# Altium project SMPSProject.PrjPcb
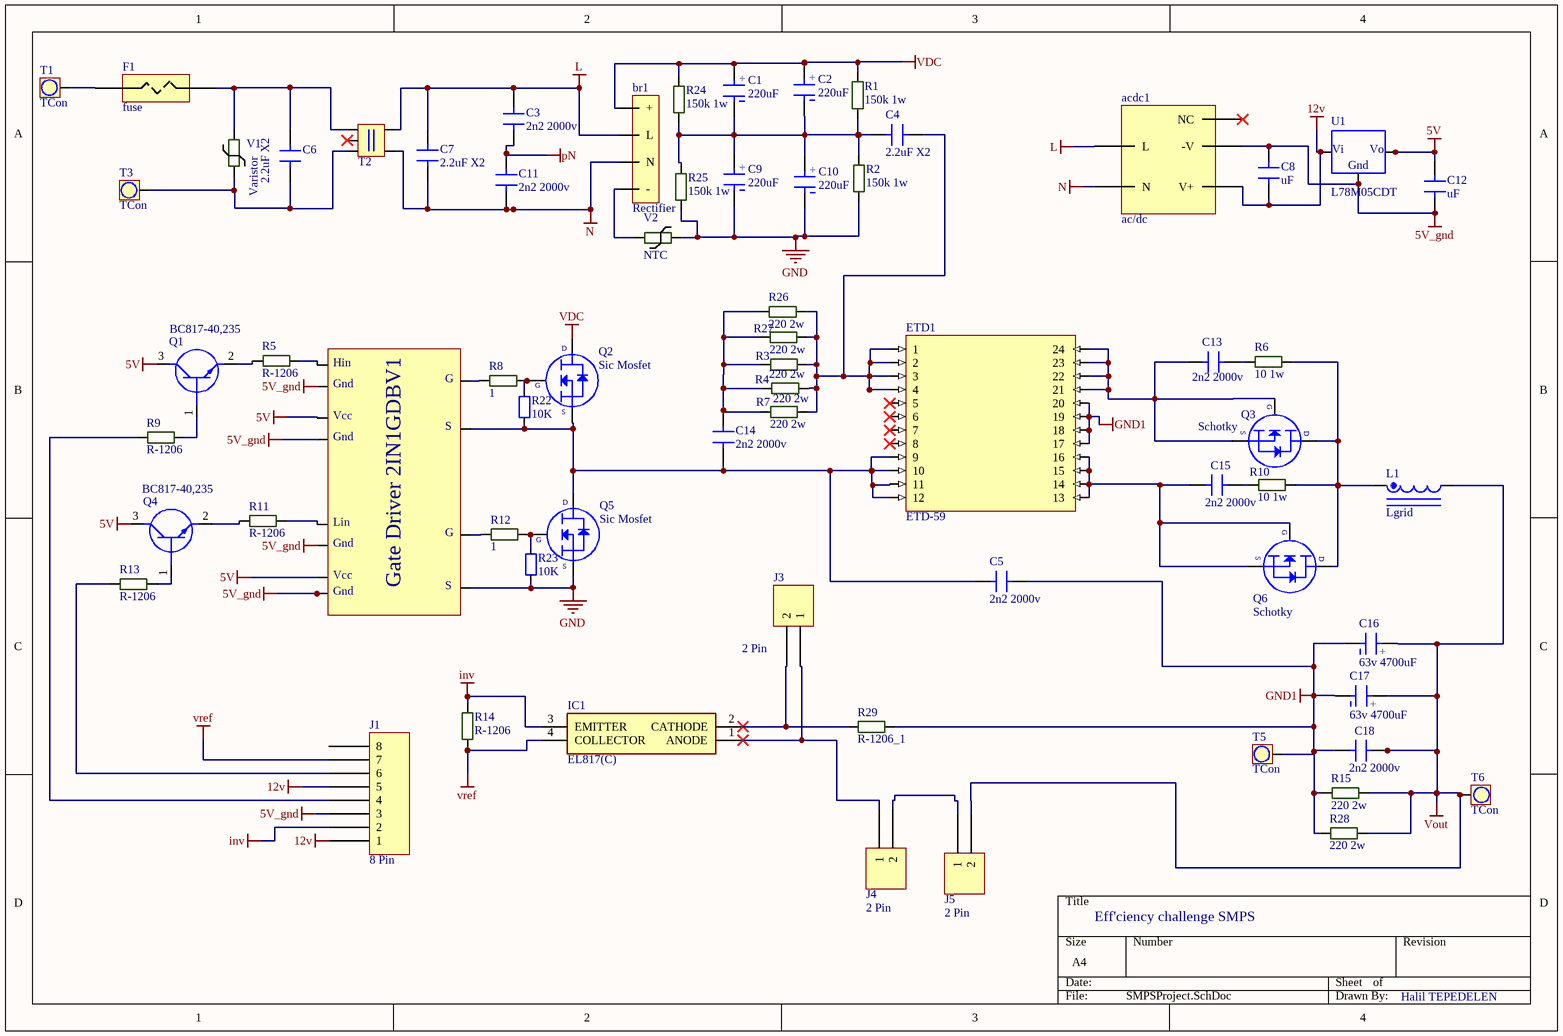
[diagram p0: SMPSProject.SchDoc]
2 sheets, 82 parts. Net scope: global (net labels, ports and power ports of the same name join across sheets).
Board files: SMPSProject.PcbDoc, controller.PcbDoc
Sheets:
  SMPSProject.SchDoc
  controller.SchDoc

## Sheet SMPSProject.SchDoc
size A4; SheetNumber: 1; SheetTotal: 2

### Parts
acdc1  ac/dc  [ac/dc]
br1  Rectifier  [Rectifier]
C1  220uF  [Koshin]
C2  220uF  [Koshin]
C3  2n2 2000v  [2n2 2000v]
C4  2.2uF X2  [CAP.POL 2.2UF  x2]
C5  2n2 2000v  [2n2 2000v]
C6  2.2uF X2  [CAP.POL 2.2UF  x2]
C7  2.2uF X2  [CAP.POL 2.2UF  x2]
C8  uF  [C-1206]
C9  220uF  [Koshin]
C10  220uF  [Koshin]
C11  2n2 2000v  [2n2 2000v]
C12  uF  [C-1206]
C13  2n2 2000v  [2n2 2000v]
C14  2n2 2000v  [2n2 2000v]
C15  2n2 2000v  [2n2 2000v]
C16  63v 4700uF  [Koshin 63v 4700 cap]
C17  63v 4700uF  [Koshin 63v 4700 cap]
C18  2n2 2000v  [2n2 2000v]
ETD1  ETD-59  [ETD-59]
F1  fuse  [fuse holder]
G1  GateDriver Board  [Gate Driver]  (value not drawn)
IC1  EL817(C)  [DIP762W60P254L458H480Q4N]
J1  8 Pin  [8 pin connector]
J3  2 Pin  [2pin]
J4  2 Pin  [2pin]
J5  2 Pin  [2pin]
L1  Lgrid  [Lgrid]
Q1  BC817-40,235  [SOT95P230X110-3N]
Q2  Sic Mosfet  [IFX-PG-TO247-3-41]
Q3  Schotky  [IFX-PG-TO247-3-41]
Q4  BC817-40,235  [SOT95P230X110-3N]
Q5  Sic Mosfet  [IFX-PG-TO247-3-41]
Q6  Schotky  [IFX-PG-TO247-3-41]
R1  150k 1w  [R-2512]
R2  150k 1w  [R-2512]
R3  220 2w  [R-2512]
R4  220 2w  [R-2512]
R5  R-1206  [R-1206]
R6  10 1w  [R-2512]
R7  220 2w  [R-2512]
R8  1  [R-2512W]
R9  R-1206  [R-1206]
R10  10 1w  [R-2512]
R11  R-1206  [R-1206]
R12  1  [R-2512W]
R13  R-1206  [R-1206]
R14  R-1206  [R-1206]
R15  220 2w  [R-2512]
R22  10K  [R-0805R]
R23  10K  [R-0805R]
R24  150k 1w  [R-2512]
R25  150k 1w  [R-2512]
R26  220 2w  [R-2512]
R27  220 2w  [R-2512]
R28  220 2w  [R-2512]
R29  R-1206_1  [R-1206]
T1  TCon  [tCon]
T2  Transformer  [Transformer]  (value not drawn)
T3  TCon  [tCon]
T5  TCon  [tCon]
T6  TCon  [tCon]
U1  L78M05CDT  [TO-252]
V1  Varistor  [varistor]
V2  NTC  [varistor]

### Nets
5V: C12.2 G1.3 G1.7 Q1.3(C) Q4.3(C) U1.2
5V_gnd: acdc1.4(-V) C8.2 C12.1 G1.2 G1.4 G1.6 G1.8 J1.3 U1.3
12v: acdc1.5(V+) C8.1 J1.1 J1.5 U1.1
GND: C9.1 C10.1 G1.12 Q5.3 R2.1 R23.1 R25.1 V2.1
GND1: C5.1 C16.1 C17.1 C18.2 ETD1.17 ETD1.18 ETD1.19 ETD1.20 R15.2 R28.2 R29.2 T5.1
inv: IC1.3(EMITTER) J1.2 R14.1
L: acdc1.1(L) br1.2(L) C3.2 C7.2 T2.2
N: acdc1.2(N) br1.3(N) C7.1 C11.1 T2.1
pN: C3.1 C11.2
VDC: br1.1(+) C1.2 C2.2 Q2.2 R1.2 R24.2
Vout: C16.2 C17.2 C18.1 J5.2 L1.2 R15.1 R28.1 T6.1
vref: IC1.4(COLLECTOR) J1.7 R14.2
Netbr1_4: br1.4(-) V2.2
NetC1_1: C1.1 C2.1 C4.2 C9.2 C10.2 R1.1 R2.2 R24.1 R25.2
NetC4_1: C4.1 ETD1.1 ETD1.2 ETD1.3 ETD1.4 R3.1 R4.1 R7.1 R26.1 R27.1
NetC5_2: C5.2 C14.1 ETD1.9 ETD1.10 ETD1.11 ETD1.12 G1.10 Q2.3 Q5.2 R22.1
NetC6_1: C6.1 T2.4 T3.1 V1.1
NetC6_2: C6.2 F1.1 T2.3 V1.2
NetC13_1: C13.1 R6.1
NetC13_2: C13.2 ETD1.21 ETD1.22 ETD1.23 ETD1.24 Q3.1 Q3.3
NetC14_2: C14.2 R3.2 R4.2 R7.2 R26.2 R27.2
NetC15_1: C15.1 R10.1
NetC15_2: C15.2 ETD1.13 ETD1.14 ETD1.15 ETD1.16 Q6.1 Q6.3
NetF1_2: F1.2 T1.1
NetG1_1: G1.1 R5.2
NetG1_5: G1.5 R11.2
NetG1_9: G1.9 R8.1
NetG1_11: G1.11 R12.1
NetIC1_1: IC1.1(ANODE) J3.1 J4.1
NetIC1_2: IC1.2(CATHODE) J3.2 R29.1
NetJ1_4: J1.4 R9.1
NetJ1_6: J1.6 R13.1
NetJ4_2: J4.2 J5.1
NetL1_1: L1.1 Q3.2 Q6.2 R6.2 R10.2
NetQ1_1: Q1.1(B) R9.2
NetQ1_2: Q1.2(E) R5.1
NetQ2_1: Q2.1 R8.2 R22.2
NetQ4_1: Q4.1(B) R13.2
NetQ4_2: Q4.2(E) R11.1
NetQ5_1: Q5.1 R12.2 R23.2

Not connected (* = marked no-connect by the designer): acdc1 3(NC)*; ETD1 5* 6* 7* 8*; J1 8; T2 5*

### Notes on the sheet
- Eff'ciency challenge SMPS
- Halil TEPEDELEN
- (in symbol Aluminum Electrolytic Capacitors) +
- (in symbol CAP.EL.220uF 500V) +
- (in symbol GateDriver Board) Hin; G; Gnd; Vcc; S; Lin; Gate Driver 2IN1GDBV1
- (in symbol L78M15CDT_1) Vi; Vo; Gnd
- (in symbol Sic Mosfet To247) D; G; S

### Library data of the parts
C1 C2 C9 C10 = CAP.EL.220uF 500V: ComponentLink1Description: https://www.ozdisan.com/pasif-komponentler/kondansatorler/aluminyum-kondansatorler/K055002210PM0E040; ComponentLink1URL: https://www.ozdisan.com/pasif-komponentler/kondansatorler/aluminyum-kondansatorler/K055002210PM0E040
C8 C12 = C-1206
C16 C17 = Aluminum Electrolytic Capacitors: PKL5-063V472MM450 Aluminum Electrolytic Capacitors - Snap In 63volts 4700uF 20%; Manufacturer: Nichicon; Manufacturer Part Number: LKS1J472MESZ; Capacitance: 4.7mF; Ripple Current: 3A; Life (Hours): 1000Hour; Supplier 1: Mouser; RoHS: Yes; Mount: Through Hole; Case/Package: Radial; Min Operating Temperature: -40°C; Max Operating Temperature: 85°C; Package Quantity: 250; Voltage Rating: 63V; Tolerance: 20%; Packaging: Bulk; Voltage Rating (DC): 63V; Termination: Snap in; Diameter: 22mm; Length: 45mm; Lead Pitch: 0.394inch; Height - Seated (Max): 1.772inch; Supplier Part Number 1: 647-LKS1J472MESZ; ComponentLink2Description: https://www.ozdisan.com/pasif-komponentler/kondansatorler/aluminyum-kondansatorler/PKL5-063V472MM450; ComponentLink2URL: https://www.ozdisan.com/pasif-komponentler/kondansatorler/aluminyum-kondansatorler/PKL5-063V472MM450
IC1 = EL817(C): Integrated Circuit; Manufacturer_Name: Everlight; Datasheet Link: https://componentsearchengine.com/Datasheets/1/EL817(C).pdf; Height: 4.8mm; Manufacturer_Part_Number: EL817(C); Mouser Part Number: 638-EL817C; Mouser Price/Stock: https://www.mouser.com/Search/Refine.aspx?Keyword=638-EL817C
Q1 Q4 = BC817-40,235: Transistor BJT NPN; Manufacturer_Name: Nexperia; Datasheet Link: http://assets.nexperia.com/documents/data-sheet/BC817_BC817W_BC337.pdf; Height: 1.1mm; Manufacturer_Part_Number: BC817-40,235; Mouser Part Number: 771-BC817-40235; Mouser Price/Stock: https://www.mouser.com/Search/Refine.aspx?Keyword=771-BC817-40235; RS Part Number: 1707957; RS Price/Stock: http://uk.rs-online.com/web/p/products/1707957
Q2 Q3 Q5 Q6 = Sic Mosfet To247
R1-R3 R7 R15 R24-R28 = R-2512: 10 1w
R4 R6 R10 = R-2512
R5 R9 R11 R13 R14 = R-1206: Res1206
R8 R12 = 0207 melf: ComponentLink1Description: https://www.ozdisan.com/pasif-komponentler/direncler/smt-smd-direncler/M271UFG100KT20; ComponentLink1URL: https://www.ozdisan.com/pasif-komponentler/direncler/smt-smd-direncler/M271UFG100KT20
R22 R23 = 10K 0805
R29 = R-1206_1: Res1206
T1 T3 T5 T6 = Terminal Connector: ComponentLink1Description: https://www.ozdisan.com/konnektor-baglanti-elemanlari/terminal-konnektorler/vida-tipi-konnektorler/K36-00AH; ComponentLink1URL: https://www.ozdisan.com/konnektor-baglanti-elemanlari/terminal-konnektorler/vida-tipi-konnektorler/K36-00AH
U1 = L78M15CDT_1: Manufacturer: STMicroelectronics; Max Output Current: 500mA; Output Voltage: 15V; Number of Outputs: 1; Max Input Voltage: 35V; Polarity: Positive; Quiescent Current: 6mA; Output Type: Fixed; Dropout Voltage: 2V; Supplier 1: Avnet; Manufacturer Part Number: L78M15CDT; RoHS: Yes; Mount: Surface Mount; Case/Package: DPAK; Number of Pins: 3; Min Operating Temperature: 0°C; Max Operating Temperature: 150°C; Packaging: Rail/Tube; Output Current: 500mA; Min Input Voltage: 35V; Package Quantity: 75; Length: 6.6mm; Height: 2.4mm; Width: 6.2mm; Radiation Hardening: No; Supplier Part Number 1: L78M15CDT; ComponentLink1Description: link; ComponentLink1URL: https://karakoyelektronik.com/regulator/ua78m15-21734
V2 = Varistor: ComponentLink1Description: Link; ComponentLink1URL: https://ozdisan.com/power-semiconductors/circuit-protection-components/varistors/TVR10391KSY
V1 = Varistor: ComponentLink1Description: Link; ComponentLink1URL: https://ozdisan.com/power-semiconductors/circuit-protection-components/varistors/TVR10391KSY

## Sheet controller.SchDoc
size A4; SheetNumber: 2; SheetTotal: 2
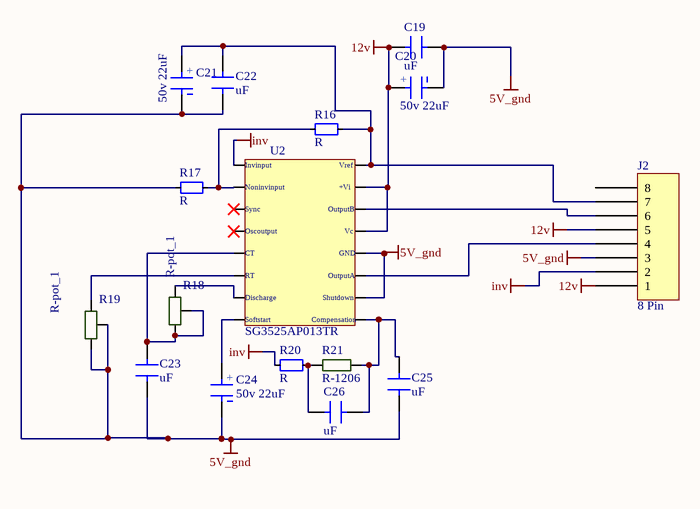
[diagram p1: controller.SchDoc]

### Parts
C19  uF  [C-1206]
C20  50v 22uF  [50v 22uf]
C21  50v 22uF  [50v 22uf]
C22  uF  [C-1206]
C23  uF  [C-1206]
C24  50v 22uF  [50v 22uf]
C25  uF  [C-1206]
C26  uF  [C-1206]
J2  8 Pin  [8 pin connector]
R16  R  [R-0805R]
R17  R  [R-0805R]
R18  R-pot_1  [pot]
R19  R-pot_1  [pot]
R20  R  [R-0805R]
R21  R-1206  [R-1206]
U2  SG3525AP013TR  [SOIC16N SG3525]

### Nets
5V_gnd: C19.1 C20.2 C21.2 C22.2 C23.1 C24.2 C25.2 J2.3 R17.1 R19.1 R19.2 U2.10 U2.12
12v: C19.2 C20.1 J2.1 J2.5 U2.13 U2.15
inv: J2.2 R20.1 U2.1
NetC21_1: C21.1 C22.1 J2.7 R16.2 U2.16
NetC23_2: C23.2 R18.1 R18.2 U2.5
NetC24_1: C24.1 U2.8
NetC25_1: C25.1 C26.2 R21.2 U2.9
NetC26_1: C26.1 R20.2 R21.1
NetJ2_4: J2.4 U2.11
NetJ2_6: J2.6 U2.14
NetR16_1: R16.1 R17.2 U2.2
NetR18_3: R18.3 U2.7
NetR19_3: R19.3 U2.6

Not connected (* = marked no-connect by the designer): J2 8; U2 3* 4*

### Notes on the sheet
- (in symbol 50v 22uF) +
- (in symbol SG3525AP013TR) Invinput; Vref; Noninvinput; +Vi; Sync; OutputB; Oscoutput; Vc; CT; GND; RT; OutputA; Discharge; Shutdown; Softstart; Compensation

### Library data of the parts
C19 C22 C23 C25 C26 = C-1206
C20 C21 C24 = 50v 22uF: Manufacturer: Nichicon; Manufacturer Part Number: LKS1J472MESZ; Capacitance: 4.7mF; Voltage Rating: 63V; Tolerance: 20%; Ripple Current: 3A; Life (Hours): 1000Hour; Supplier 1: Mouser; RoHS: Yes; Mount: Through Hole; Case/Package: Radial; Min Operating Temperature: -40°C; Max Operating Temperature: 85°C; Package Quantity: 250; Packaging: Bulk; Voltage Rating (DC): 63V; Termination: Snap in; Diameter: 22mm; Length: 45mm; Lead Pitch: 0.394inch; Height - Seated (Max): 1.772inch; Supplier Part Number 1: 647-LKS1J472MESZ; ComponentLink3Description: Link; ComponentLink3URL: https://ozdisan.com/passive-components/capacitors/aluminum-capacitors/MRW-050V220ME057-TR
R16 R17 R20 = R 0805
R18 R19 = R-pot_1: Res1206
R21 = R-1206: Res1206
U2 = SG3525AP013TR: IC REG CTRLR BCK/PSH-PULL 16SOIC; Manufacturer: STMicroelectronics; Max Supply Voltage: 35V; Output Current: 400A; Rise Time: 100ns; Number of Outputs: 2; Switching Frequency: 400kHz; Output Voltage: 5.2V; Max Frequency: 500kHz; Duty Cycle: 49%; Fall Time: 50ns; Operating Supply Current: 14mA; Max Supply Current: 20mA; Supplier 1: Digi-Key; RoHS: Yes; Stock 1: 5712; Pricing 1: 1 = 1,58000, 10 = 1,41600, 100 = 1,10400, 500 = 0,91196, 1000 = 0,71997 (USD); Mount: Surface Mount; Number of Pins: 16; Weight: 0.007079oz; Min Operating Temperature: 0°C; Max Operating Temperature: 70°C; Packaging: Tape and Reel; Package Quantity: 1; Max Duty Cycle: 49%; Radiation Hardening: No; Lead Free: Lead Free; ComponentLink1URL: http://www.st.com/content/ccc/resource/technical/document/datasheet/c0/12/98/4a/3b/1a/4b/8b/CD00000958.pdf/files/CD00000958.pdf/jcr:content/translations/en.CD00000958.pdf?src-supplier=Digi-Key; ComponentLink1Description: http://www.st.com/content/ccc/resource/technical/document/datasheet/c0/12/98/4a/3b/1a/4b/8b/CD00000958.pdf/files/CD00000958.pdf/jcr:content/translations/en.CD00000958.pdf?src-supplier=Digi-Key; ComponentLink2URL: https://www.verical.com/server-webapp/html/getDatasheet?partID=376579&src-supplier=Verical; ComponentLink2Description: https://www.verical.com/server-webapp/html/getDatasheet?partID=376579&src-supplier=Verical; ComponentLink3URL: http://www.produktinfo.conrad.com/datenblaetter/1100000-1199999/001185611-da-01-en-IC_REG_CTRLR_P_SG3525AP013TR_SOIC_16_STM.pdf?src-supplier=Conrad; ComponentLink3Description: http://www.produktinfo.conrad.com/datenblaetter/1100000-1199999/001185611-da-01-en-IC_REG_CTRLR_P_SG3525AP013TR_SOIC_16_STM.pdf?src-supplier=Conrad; Case/Package: SOIC; Supplier Part Number 1: 497-6479-1-ND; Manufacturer Part Number: SG3525AP013TR

## Nets that join several sheets
5V_gnd: SMPSProject (9 pins), controller (13 pins)
12v: SMPSProject (5 pins), controller (6 pins)
inv: SMPSProject (IC1.3 J1.2 R14.1), controller (J2.2 R20.1 U2.1)